# EAGLE design H-Motor_Driver_0_1 (EAGLE 5.10)
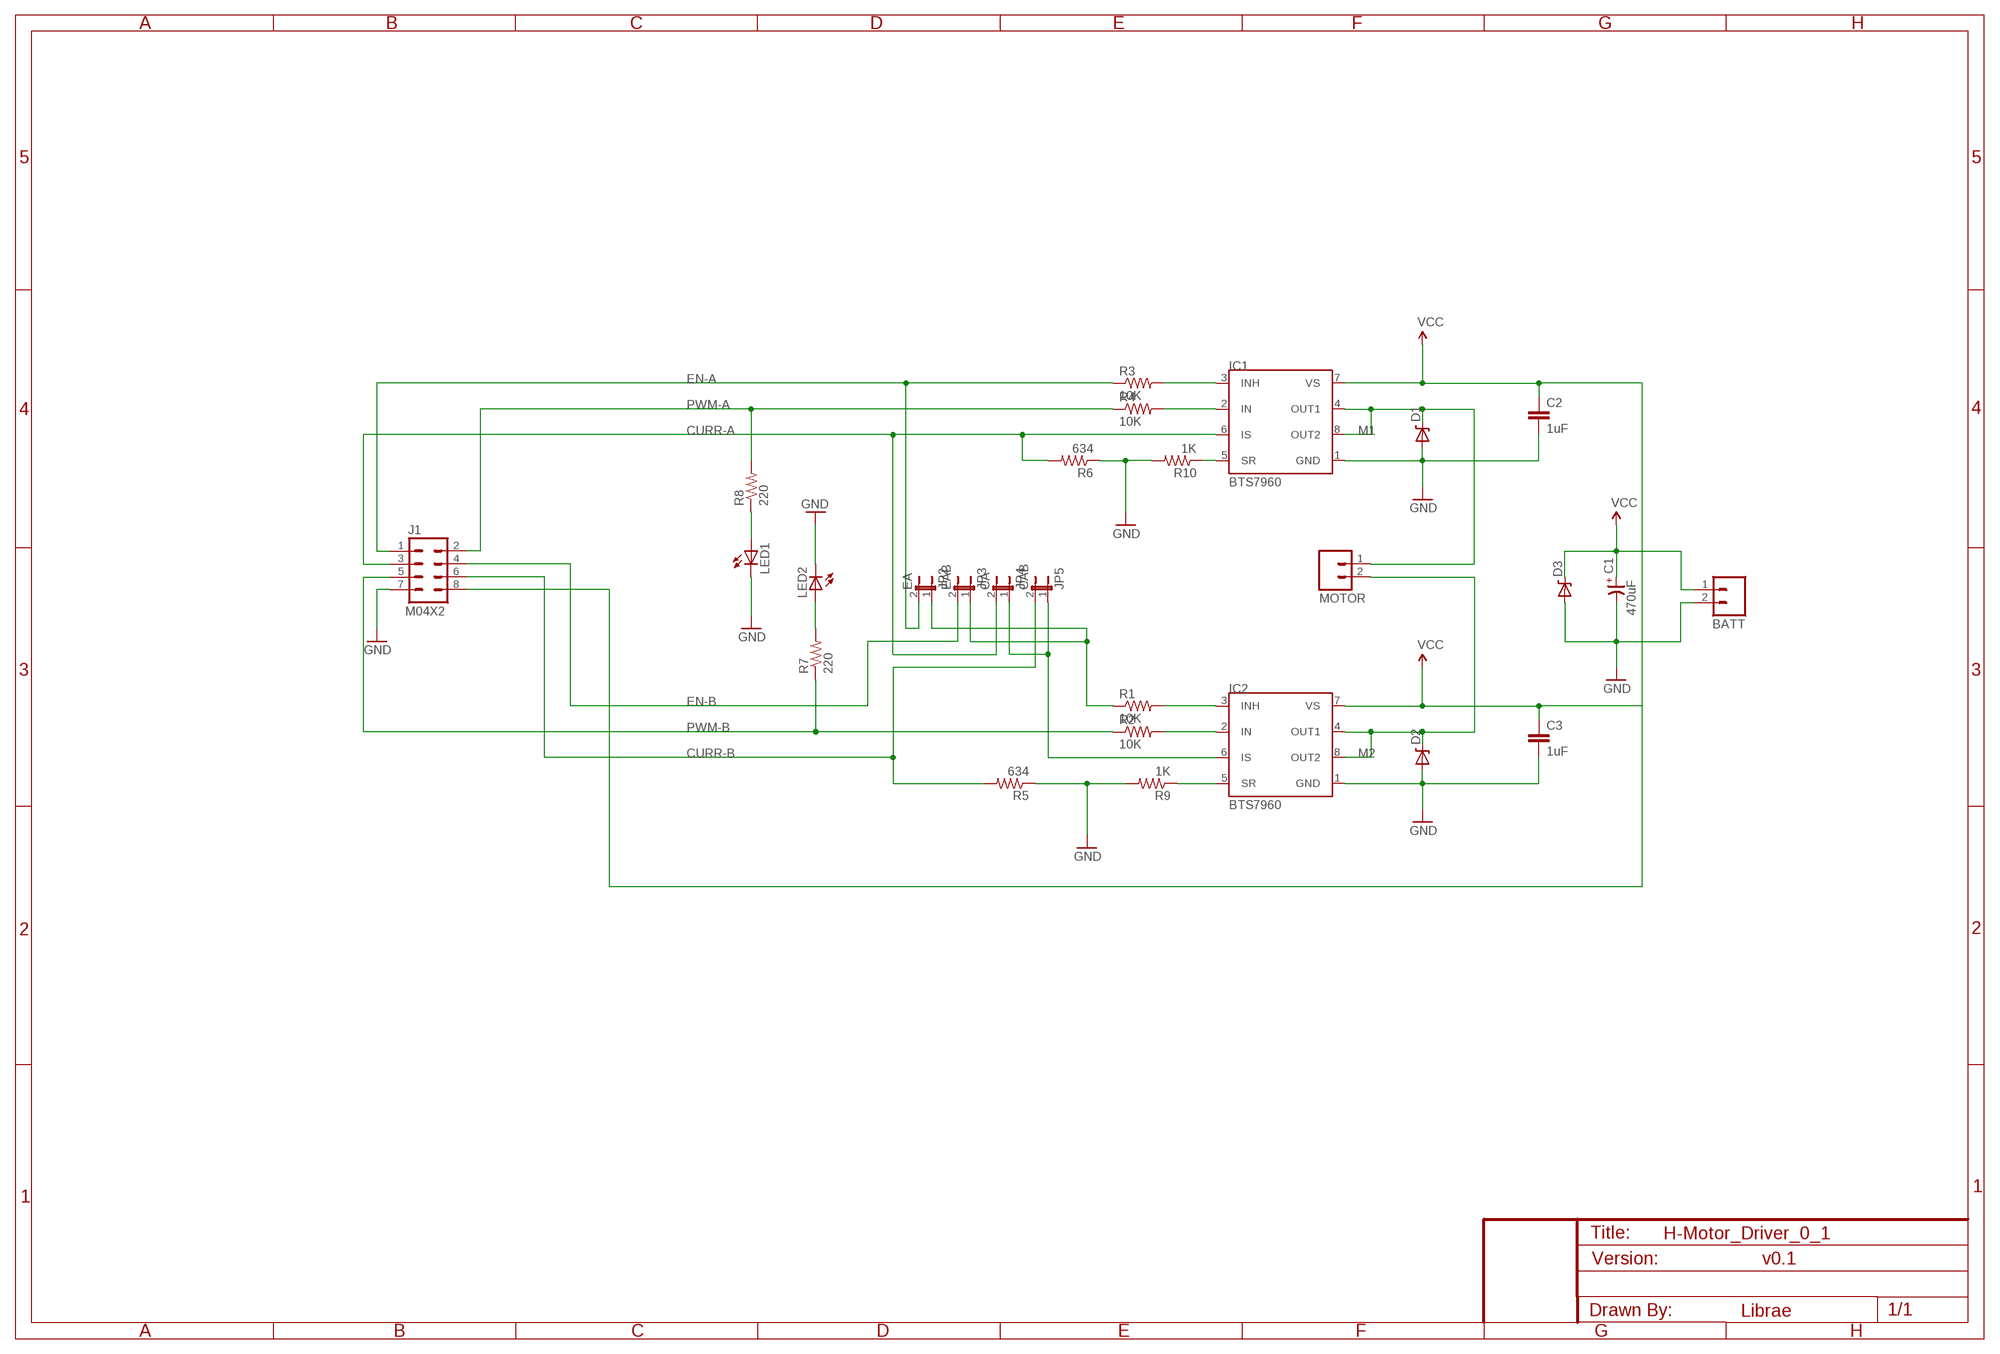
[diagram p0: schematic, sheet 1]

## Parts
BATT  M023.5MM  [SCREWTERMINAL-3.5MM-2]
C1  470uF  CP-E-035X080  [E-035X080]
C2  1uF  CAP0805  [0805]
C3  1uF  CAP0805  [0805]
D1  DIODE-ZENERSMB  [SMB-DIODE]
D2  DIODE-ZENERSMB  [SMB-DIODE]
D3  DIODE-ZENERSMB  [SMB-DIODE]
IC1  BTS7960  [P-TO263-7-1]
IC2  BTS7960  [P-TO263-7-1]
J1  M04X2  [2X4]
JP2  EA  JUMPER-2SMD-NC  [SJ_2S]
JP3  EAB  JUMPER-2SMD-NC  [SJ_2S]
JP4  CA  JUMPER-2SMD-NC  [SJ_2S]
JP5  CAB  JUMPER-2SMD-NC  [SJ_2S]
LED1  LED0603  [LED-0603]
LED2  LED0603  [LED-0603]
MOTOR  M023.5MM  [SCREWTERMINAL-3.5MM-2]
R1  10K  RESISTOR0603-RES  [0603-RES]
R2  10K  RESISTOR0603-RES  [0603-RES]
R3  10K  RESISTOR0603-RES  [0603-RES]
R4  10K  RESISTOR0603-RES  [0603-RES]
R5  634  RESISTOR0603-RES  [0603-RES]
R6  634  RESISTOR0603-RES  [0603-RES]
R7  220  RESISTOR0603-RES  [0603-RES]
R8  220  RESISTOR0603-RES  [0603-RES]
R9  1K  RESISTOR0603-RES  [0603-RES]
R10  1K  RESISTOR0603-RES  [0603-RES]

## Nets
CURR-A: IC1.6(IS) J1.3 JP4.2 R6.2
CURR-B: J1.6 JP5.2 R5.2
EN-A: J1.1 JP2.2 R3.1
EN-B: J1.4 JP3.2
GND: BATT.2 C1.- C2.2 C3.2 D1.A D2.A D3.A IC1.1(GND) IC2.1(GND) J1.7 LED1.C LED2.C R5.1 R6.1 R9.2 R10.2
M1: D1.C IC1.4(OUT1) IC1.8(OUT2) MOTOR.1
M2: D2.C IC2.4(OUT1) IC2.8(OUT2) MOTOR.2
N$1: IC2.3(INH) R1.2
N$2: JP2.1 JP3.1 R1.1
N$3: IC2.2(IN) R2.2
N$4: LED1.A R8.1
N$5: IC2.6(IS) JP4.1 JP5.1
N$6: LED2.A R7.2
N$7: IC1.3(INH) R3.2
N$8: IC1.2(IN) R4.2
N$9: IC1.5(SR) R10.1
N$10: IC2.5(SR) R9.1
PWM-A: J1.2 R4.1 R8.2
PWM-B: J1.5 R2.1 R7.1
VCC: BATT.1 C1.+ C2.1 C3.1 D3.C IC1.7(VS) IC2.7(VS) J1.8

## Notes on the sheet
- v0.1

## Library data of the parts
BATT MOTOR = SparkFun:M02: Header 2 Standard 2-pin 0.1" header. Use with straight break away headers (SKU : PRT-00116), right angle break away headers (PRT-00553), swiss pins (PRT-00743), machine pins (PRT-00117), and female headers (PRT-00115). Molex polarized connector foot print use with SKU : PRT-08233 with associated crimp pins and housings.
C1 = cap-master:CP-: POLARIZED CAP
C2 C3 = SparkFun:CAP: Capacitor Standard 0603 ceramic capacitor, and 0.1" leaded capacitor.
D1-D3 = SparkFun:DIODE-ZENER: Zener Diode Production Part - 8199 3.4V Zener Voltage
IC1 IC2 = infineon:BTS7960: High Current PN Half Bridge
J1 = SparkFun:M04X2
JP2-JP5 = SparkFun:JUMPER-2: Jumper Basic 0.1" spaced jumper. Use with breakaway headers.
LED1 LED2 = SparkFun:LED: LEDs Standard schematic elements and footprints for 5mm, 3mm, 1206, and 0603 sized LEDs. 5mm - Spark Fun Electronics SKU : COM-00529 (and others)
R1-R10 = SparkFun:RESISTOR: Resistor Basic schematic elements and footprints for 0603, 1206, and PTH 1/10th watt (small) resistors.

## Board
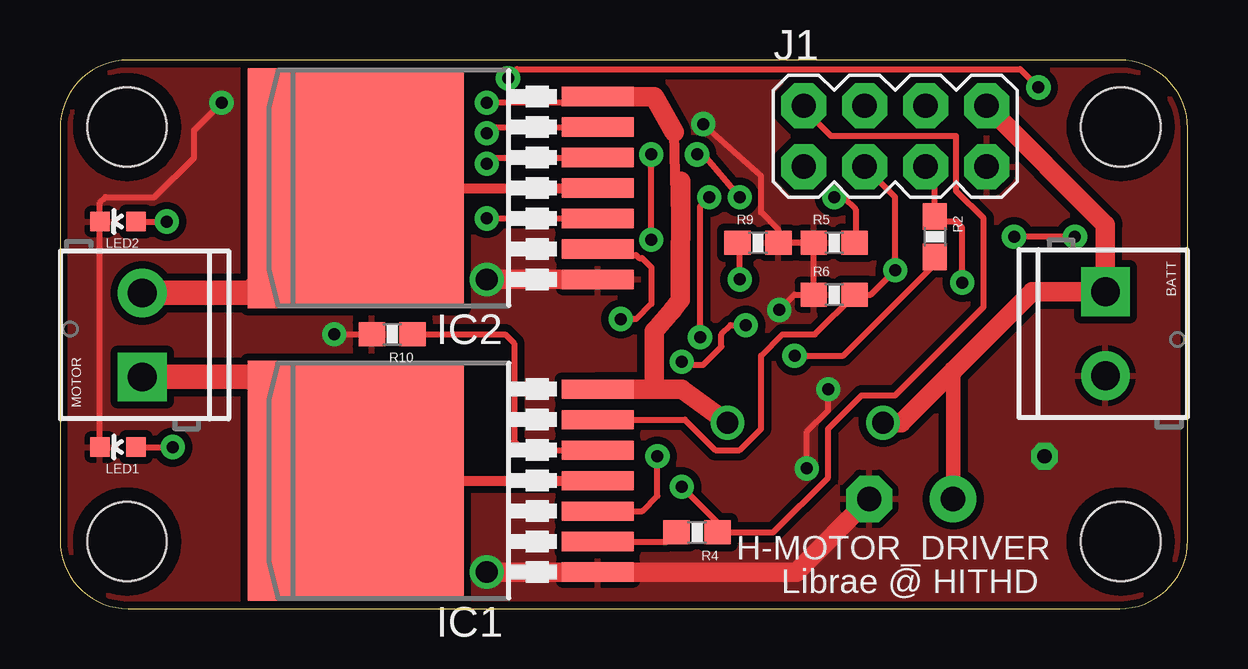
[diagram p1: board, top side]
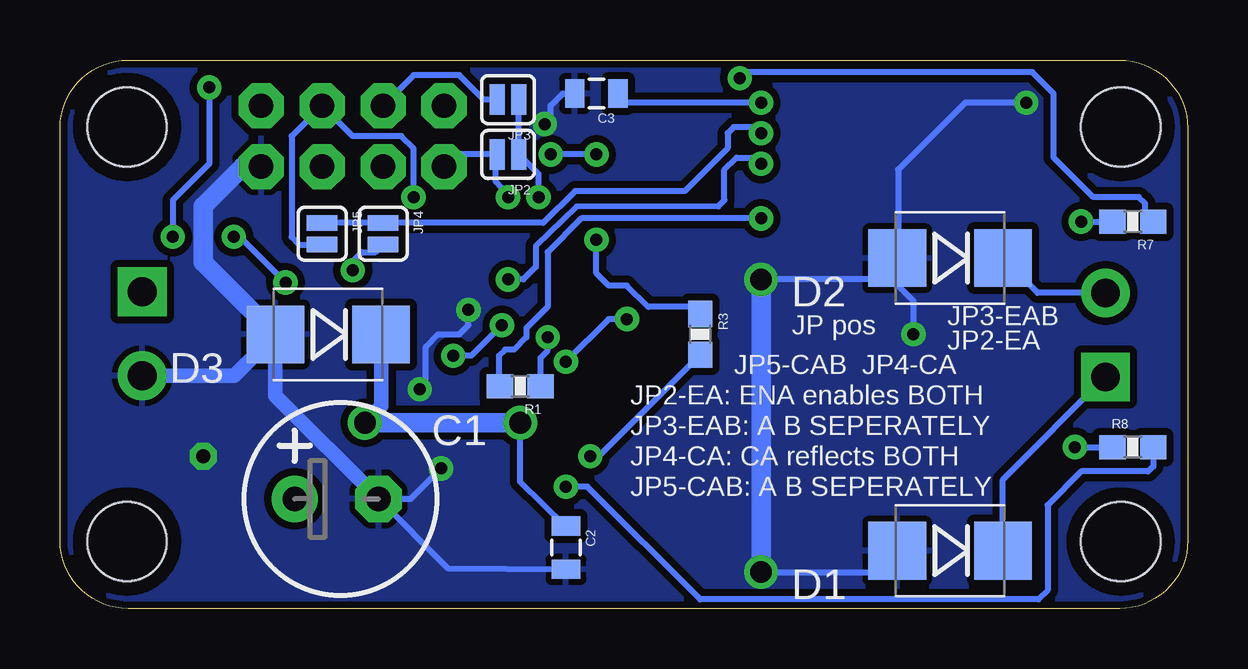
[diagram p2: board, bottom side, seen from below]

Size 46.99 x 22.86 mm. Coordinates in mm from the lower left corner, seen from the top.
Outline: 46.99,20.02 arc90 44.15,22.86 2.84,22.86 arc90 0,20.02 0,2.84 arc90 2.84,0 44.15,0 arc90 46.99,2.84 46.99,20.02
Copper layers (1*16): Top 0.035mm / dielectric 1.5mm / Bottom 0.035mm
Design rules "SparkFun": minimum track width 8mil, minimum drill 20mil, track to track 8mil, track to pad 8mil, pad to pad 8mil, via to via 8mil, smd to smd 8mil, copper to edge 10mil, drill to drill 8mil, minimum pad ring 12mil, minimum via ring 10mil, stop-mask expansion 4mil, vias tented up to drill 25mil, thermal gap 10mil

### Footprints (pad centres in the part's own frame; a part is rotated, then mirrored left to right if it is on the bottom)
SCREWTERMINAL-3.5MM-2 = drill 1.2 pad 2.032 square: 1 0,0 | drill 1.2 pad 2.032 round: 2 3.5,0
E-035X080 = drill 1.016 pad 1.93 round: + -1.905,0 | drill 1.016 pad 1.93 octagon: - 1.587,0
0805 = smd 0.8 x 1.2: 1 -0.9,0; 2 0.9,0
SMB-DIODE = smd 2.4 x 2.4: A 2.2,0; C -2.2,0
P-TO263-7-1 = smd 0.8 x 3: 1 -3.81,-9.207; 2 -2.54,-9.207; 3 -1.27,-9.207; 4 0,-9.207; 5 1.27,-9.207; 6 2.54,-9.207; 7 3.81,-9.207 | smd 10 x 9: 8 0,0.895
2X4 = drill 1.016 pad 1.88 octagon: 1 -3.81,-1.27; 2 -3.81,1.27; 3 -1.27,-1.27; 4 -1.27,1.27; 5 1.27,-1.27; 6 1.27,1.27; 7 3.81,-1.27; 8 3.81,1.27
SJ_2S = smd 0.635 x 1.27: 1 -0.45,0; 2 0.45,0
LED-0603 = smd 0.8 x 0.8: A 0,-0.75; C 0,0.75
0603-RES = smd 1.1 x 1: 1 -0.85,0; 2 0.85,0
STAND-OFF = hole 3.302: 0,0

### Placement (x,y rotation side)
BATT  43.56,13.21 270 top
C1  35.31,4.57 0 bottom
C2  25.91,2.54 270 bottom
C3  24.64,21.46 180 bottom
D1  9.91,2.41 180 bottom
D2  9.91,14.61 180 bottom
D3  35.81,11.43 180 bottom
IC1  13.21,5.33 90 top
IC2  13.21,17.53 90 top
J1  34.8,19.68 0 top
JP2  28.32,18.92 180 bottom
JP3  28.32,21.21 180 bottom
JP4  33.53,15.62 270 bottom
JP5  36.07,15.62 270 bottom
LED1  2.41,6.73 90 top
LED2  2.41,16.13 90 top
MOTOR  3.43,9.65 90 top
R1  27.81,9.27 180 bottom
R2  36.45,15.49 270 top
R3  20.32,11.43 270 bottom
R4  26.54,3.17 180 top
R5  32.26,15.24 0 top
R6  32.26,13.08 0 top
R7  2.29,16.13 180 bottom
R8  2.29,6.73 0 bottom
R9  29.08,15.24 0 top
R10  13.84,11.43 180 top
U$1  [STAND-OFF]  2.79,20.07 0 top
U$2  [STAND-OFF]  44.2,20.07 0 top
U$4  [STAND-OFF]  44.2,2.79 0 top
U$5  [STAND-OFF]  2.79,2.79 0 top

### Tracks (layer width: path | path; a pad name or v marks a point on that pad's centre or on a via)
CURR-A  (via drill 0.5)
  Top 0.254: IC1.6 26.04,7.87 27.3,6.6 28.32,6.6 29.21,7.49 29.21,10.54 30.1,11.43 31.46,11.43 R6.2 33.78,13.08 v34.8,14.1 34.8,17.14 J1.3
  Bottom 0.254: v34.8,14.1 34.8,14.48 34.42,14.86 33.84,14.86 JP4.2
CURR-B  (via drill 0.5)
  Top 0.254: R5.2 33.15,15.28 33.15,16.64 32.64,17.14 v32.26,17.14
  Bottom 0.254: JP5.2 37.02,15.17 37.34,15.49 37.34,19.68 J1.6 34.8,19.68 32.77,19.68 32.26,19.18 v32.26,17.14
EN-A  (via drill 0.5)
  Top 0.254: v24.64,15.37 v24.64,18.92 | v26.54,18.92 26.8,18.92 v28.32,17.14
  Bottom 0.254: JP2.2 30.48,18.92 J1.1 | JP2.2 28.7,18.85 | R3.1 20.61,12.57 22.48,12.57 23.37,13.46 24.13,13.46 24.64,13.97 v24.64,15.37 | v24.64,18.92 v26.54,18.92 | v28.32,17.14 28.57,17.53 28.83,17.78 28.83,18.86 JP2.2
EN-B
  Bottom 0.254: JP3.2 29.34,21.21 30.35,22.23 32.26,22.23 J1.4
GND  (via drill 0.5, 0.6, 0.9)
  Top 0.254: LED1.C LED2.C 1.66,16.9 1.91,17.14 3.94,17.14 5.59,18.8 5.59,19.94 v6.73,21.08 | v11.43,11.43 R10.2 | v26.8,20.19 29.21,18.03 29.21,16.51 29.93,15.79 R9.2 R5.1 R6.1 30.61,13.08 v29.97,12.45 | v31.11,5.84 31.11,7.37 32,8.26 v32,9.14
  Top 0.813: C1.- 30.67,1.52 IC1.1 v17.78,1.52 | v17.78,13.72 IC2.1
  Bottom 0.254: 25.82,1.69 C2.2 30.84,1.69 C1.- 32.38,4.57 v31.11,5.84 | v17.78,1.52 12.99,1.52 D1.A | v17.78,13.72 12.99,13.72 12.66,14.05 | 12.66,14.05 D2.A 12.06,14.65 12.06,18.29 9.27,21.08 v6.73,21.08 | v11.43,11.43 11.43,12.83 12.66,14.05 | C3.2 26.04,21.46 26.54,20.95 26.54,20.45 v26.8,20.19 | v29.97,12.45 29.97,11.81 30.35,11.43 31.24,11.43 31.75,10.92 31.75,9.4 v32,9.14
  Bottom 0.61: D3.A 39.74,9.71 BATT.2 | C1.- 38.01,8.87 D3.A | D3.A 38.61,12.02
  Bottom 0.813: v17.78,13.72 v17.78,1.52 | 38.61,12.02 41.02,14.44 41.02,16.76 39.37,18.41 J1.7
  other vias: 41.02,6.35
  pour Bottom (isolate 0.305): 0,20.32 0,2.54 arc90 2.54,0 44.45,0 arc90 46.99,2.54 46.99,20.32 arc90 44.45,22.86 2.54,22.86 arc90
  pour Top (isolate 0.305): 44.15,0 arc90 46.99,2.84 46.99,20.02 arc90 44.15,22.86 2.84,22.86 arc90 0,20.02 0,2.84 arc90 2.84,0
M1
  Top 0.406: IC1.8 IC1.4
  Top 1.016: IC1.8 8,9.65 MOTOR.1
  Bottom 0.254: D1.C 7.71,5.38 MOTOR.1
M2
  Top 0.406: IC2.8 IC2.4
  Top 1.016: IC2.8 7.94,13.15 MOTOR.2
  Bottom 0.254: D2.C 6.25,13.15 MOTOR.2
N$1  (via drill 0.5)
  Top 0.254: v17.78,16.26 IC2.3
  Bottom 0.254: v17.78,16.26 25.27,16.26 26.67,14.86 26.67,12.57 27.56,11.68 27.56,11.3 28.07,10.79 28.45,10.79 28.7,10.54 28.7,9.31 R1.2
N$2  (via drill 0.5)
  Top 0.254: v27.05,17.14 26.67,16.76 v26.67,11.3
  Bottom 0.254: JP3.1 JP2.1 27.05,18.1 v27.05,17.14 | R1.1 26.96,10.45 26.67,10.75 v26.67,11.3
N$3  (via drill 0.5)
  Top 0.254: R2.2 36.45,14.35 32.64,10.54 v30.61,10.54 | v28.57,11.81 27.94,11.81 27.56,11.43 27.56,10.92 26.8,10.16 26.04,10.16 v25.91,10.29 | v23.37,12.06 24,12.06 24.64,12.7 24.64,14.22 24.26,14.61 24.13,14.61 24,14.73 22.67,14.73 IC2.2
  Bottom 0.254: v30.61,10.54 29.84,10.54 v28.57,11.81 | v25.91,10.29 24.13,12.06 v23.37,12.06
N$4  (via drill 0.5)
  Top 0.254: LED1.A v4.7,6.73
  Bottom 0.254: v4.7,6.73 R8.1
N$5  (via drill 0.5)
  Top 0.254: IC2.6 18.03,20.07 v17.78,19.81
  Bottom 0.254: JP5.1 JP4.1 26.86,16.07 25.53,17.4 20.95,17.4 19.18,19.18 19.18,19.81 18.92,20.07 18.03,20.07 v17.78,19.81
N$6  (via drill 0.5)
  Top 0.254: LED2.A v4.45,16.13
  Bottom 0.254: v4.45,16.13 R7.2
N$7  (via drill 0.5)
  Top 0.254: IC1.3 24.26,4.06 24.89,4.7 v24.89,6.35
  Bottom 0.254: R3.2 24.55,6.35 v24.89,6.35
N$8
  Top 0.254: R4.2 25.31,2.79 IC1.2
N$9
  Top 0.254: R10.1 18.54,11.43 18.92,11.05 18.92,6.99 19.3,6.6 IC1.5
N$10  (via drill 0.5)
  Top 0.254: v28.32,13.72 28.32,15.15 R9.1 | IC2.5 18.03,18.8 v17.78,18.54
  Bottom 0.254: v28.32,13.72 27.69,13.72 27.16,14.24 27.16,15.11 25.48,16.75 19.56,16.76 19.3,17.02 19.3,18.29 18.8,18.8 18.03,18.8 v17.78,18.54
PWM-A  (via drill 0.5)
  Top 0.254: v25.91,5.08 27.39,3.6 R4.1 29.72,3.17 32,5.46 32,7.49 33.4,8.89 34.8,8.89 38.48,12.57 38.48,16.26 37.34,17.4 37.34,19.68 32.13,19.68 30.99,20.83 J1.2
  Bottom 0.254: R8.2 1.44,5.93 1.65,5.71 4.45,5.71 5.84,4.32 5.84,0.76 6.22,0.38 20.32,0.38 25.02,5.08 v25.91,5.08
PWM-B  (via drill 0.5)
  Top 0.254: J1.5 36.45,18.03 R2.1 36.66,16.13 37.34,16.13 37.59,15.88 v37.59,13.59 | v42.29,15.49 v39.75,15.49 | v18.67,22.1 19.05,22.48 40.01,22.48 v40.77,21.72
  Bottom 0.254: R7.1 1.78,16.47 1.78,16.89 2.03,17.14 3.94,17.14 5.59,18.8 5.59,21.46 6.48,22.35 18.29,22.35 v18.67,22.1 | v40.77,21.72 40.77,18.54 42.29,17.02 v42.29,15.49 | v39.75,15.49 39.5,15.49 v37.59,13.59
VCC  (via drill 0.5, 0.9)
  Top 0.254: 22.29,21.46 IC2.7 22.16,21.08 v17.78,21.08
  Top 0.406: BATT.1 43.56,13.34 | 25.86,17.8 25.72,14.53 25.59,19.85
  Top 0.61: 37.21,9.91 C1.+
  Top 0.813: v27.81,7.75 25.91,9.14 24.64,9.14 | 24.64,9.14 IC1.7 | v34.29,7.75 35.05,7.75 37.21,9.91 40.51,13.21 BATT.1 43.56,16 J1.8 | IC2.7 24.77,21.34 25.59,19.85 | 24.64,9.14 24.77,9.27 24.77,11.56 25.53,12.46 25.84,12.88 25.86,17.8
  Bottom 0.254: C2.1 27.81,5.29 v27.81,7.75 | v17.78,21.08 23.36,21.08 C3.1
  Bottom 0.61: v34.29,7.75 33.61,8.42 D3.C
  Bottom 0.813: v27.81,7.75 v34.29,7.75

### Text on the board
tPlace: H-MOTOR_DRIVER | Librae @ HITHD
bPlace: JP3-EAB | JP2-EA | JP pos | JP4-CA | JP5-CAB | JP2-EA: ENA enables BOTH | JP3-EAB: A B SEPERATELY | JP4-CA: CA reflects BOTH | JP5-CAB: A B SEPERATELY